# Altium schematic sheet SCH.SchDoc: MINSYS_ATMEGA328
size A4
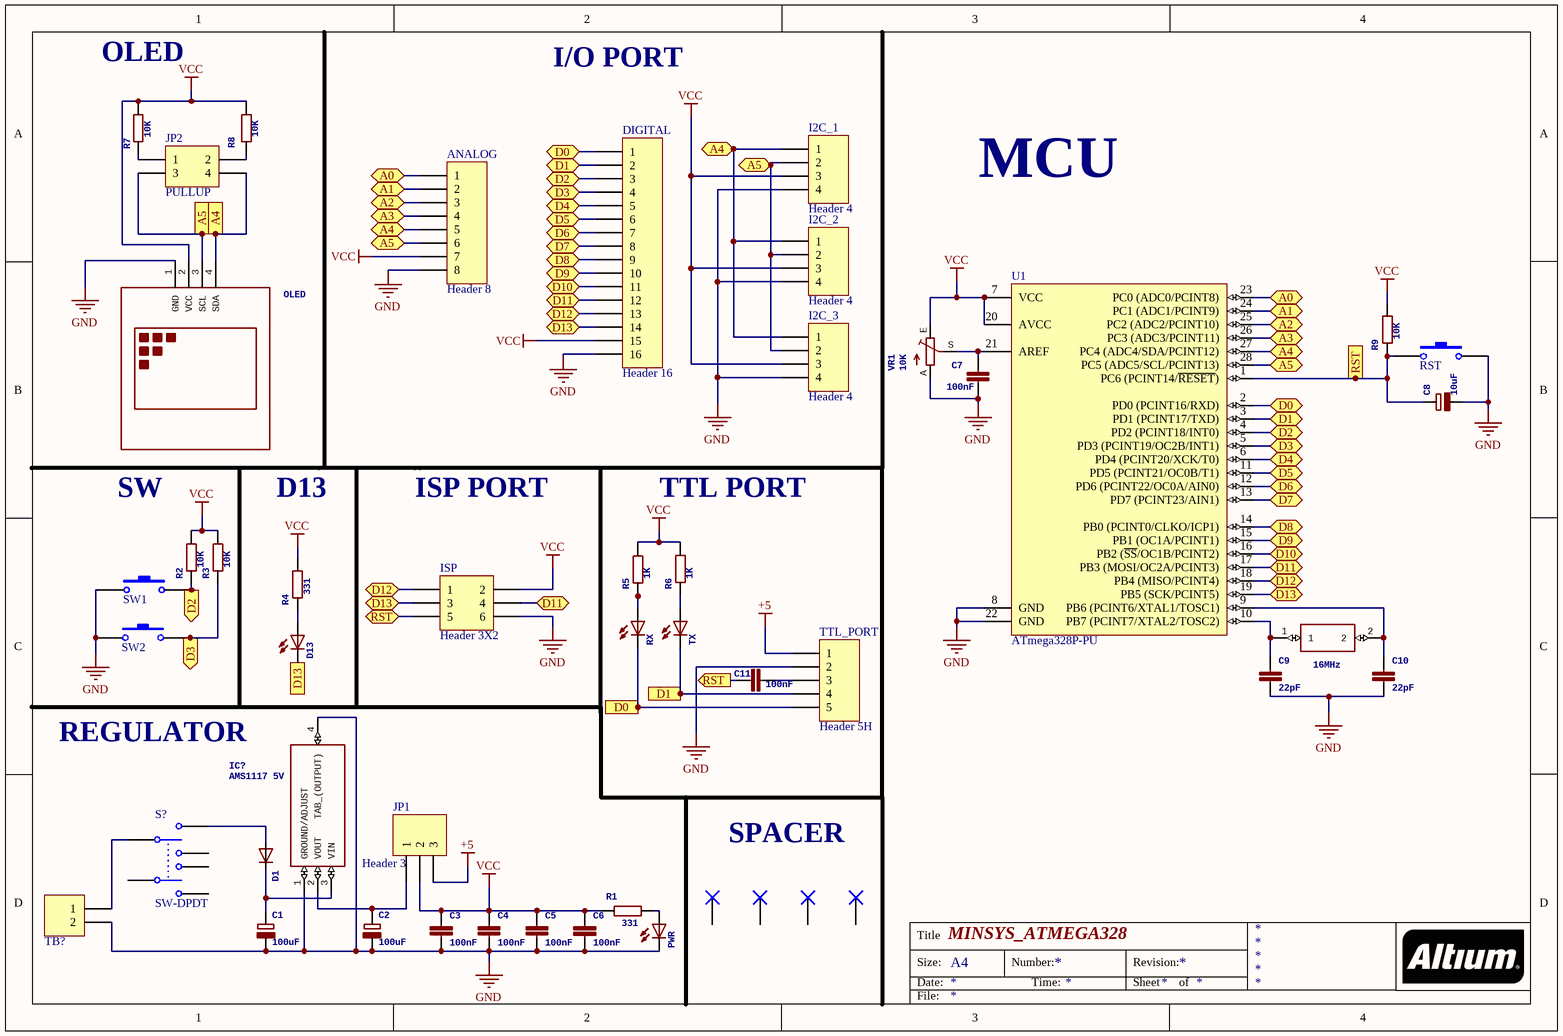
[diagram p0: SCH.SchDoc]

## Parts
(Parts that share a designator on the sheet are numbered #1, #2 ... from top to bottom, then left to right.)
?#1  Spacer  [SPACER]  (value not drawn)
?#2  Spacer  [SPACER]  (value not drawn)
?#3  Spacer  [SPACER]  (value not drawn)
?#4  Spacer  [SPACER]  (value not drawn)
ANALOG  Header 8  [HDR1X8]
C1  100uF  [153CLV-0605]
C2  100uF  [153CLV-0605]
C3  100nF  [C0805]
C4  100nF  [C0805]
C5  100nF  [C0805]
C6  100nF  [C0805]
C7  100nF  [C0805]
C8  10uF  [153CLV-0405]
C9  22pF  [C0805]
C10  22pF  [C0805]
C11  100nF  [C0805]
D1  DIODEgeneral purpose rectifier, 1 A  [DO41-10]  (value not drawn)
D13  LEDOSRAM:- CHIPLEDLG R971, LG N971, LY N971, LG Q971, LY Q971, LO R971, LY R971 LH N974, LH R974LS Q976, LO Q976, LY Q976LO Q996- Hyper CHIPLEDLW Q18SLB Q993, LB Q99A, LB R99A- SideLEDLS A670, LO A670, LY A670, LG A670, LP A670LB A673, LV A673, LT A673, LW A673LH A674LY A675LS A676, LA A676, LO A676, LY A676, LW A676LS A679, LY A679, LG A679-  Hyper Micro SIDELEDÂ®LS Y876, LA Y876, LO Y876, LY Y876LT Y87S- SmartLEDLW L88C, LW L88SLB L89C, LB L89S, LG L890LS L89K, LO L89K, LY L89KLS L896, LA L896, LO L896, LY L896- TOPLEDLS T670, LO T670, LY T670, LG T670, LP T670LSG T670, LSP T670, LSY T670, LOP T670, LYG T670LG T671, LOG T671, LSG T671LB T673, LV T673, LT T673, LW T673LH T674LS T676, LA T676, LO T676, LY T676, LB T676, LH T676, LSB T676, LW T676LB T67C, LV T67C, LT T67C, LS T67K, LO T67K, LY T67K, LW E67CLS E67B, LA E67B, LO E67B, LY E67B, LB E67C, LV E67C, LT E67CLW T67CLS T679, LY T679, LG T679LS T770, LO T770, LY T770, LG T770, LP T770LB T773, LV T773, LT T773, LW T773LH T774LS E675, LA E675, LY E675, LS T675LS T776, LA T776, LO T776, LY T776, LB T776LHGB T686LT T68C, LB T68C- Hyper Mini TOPLEDÂ®LB M676- Mini TOPLED SantanaÂ®LG M470LS M47K, LO M47K, LY M47KSource: http://www.osram.convergy.de/  [LED3MM]  (value not drawn)
DIGITAL  Header 16  [HDR1X16]
I2C_1  Header 4  [HDR1X4]
I2C_2  Header 4  [HDR1X4]
I2C_3  Header 4  [HDR1X4]
IC?  AMS1117 5V  [SOT229P700X180-4N]
ISP  Header 3X2  [HDR2X3]
JP1  Header 3  [HDR1X3]
JP2  PULLUP  [HDR2X2]
OLED  128x64 Dot Matrix OLED Module based on SSD1306 chipVariant with I2C interfaceMore details available here:http://www.instructables.com/id/Monochrome-096-i2c-OLED-display-with-arduino-SSD13/SSD1306 datasheet:https://cdn-shop.adafruit.com/datasheets/SSD1306.pdfClick here to find device on ebay.comNote: There are two variants: I2C and SPI. Search for the proper version.  [DISPLAY-OLED-128X64-I2C]  (value not drawn)
PWR  LEDOSRAM:- CHIPLEDLG R971, LG N971, LY N971, LG Q971, LY Q971, LO R971, LY R971 LH N974, LH R974LS Q976, LO Q976, LY Q976LO Q996- Hyper CHIPLEDLW Q18SLB Q993, LB Q99A, LB R99A- SideLEDLS A670, LO A670, LY A670, LG A670, LP A670LB A673, LV A673, LT A673, LW A673LH A674LY A675LS A676, LA A676, LO A676, LY A676, LW A676LS A679, LY A679, LG A679-  Hyper Micro SIDELEDÂ®LS Y876, LA Y876, LO Y876, LY Y876LT Y87S- SmartLEDLW L88C, LW L88SLB L89C, LB L89S, LG L890LS L89K, LO L89K, LY L89KLS L896, LA L896, LO L896, LY L896- TOPLEDLS T670, LO T670, LY T670, LG T670, LP T670LSG T670, LSP T670, LSY T670, LOP T670, LYG T670LG T671, LOG T671, LSG T671LB T673, LV T673, LT T673, LW T673LH T674LS T676, LA T676, LO T676, LY T676, LB T676, LH T676, LSB T676, LW T676LB T67C, LV T67C, LT T67C, LS T67K, LO T67K, LY T67K, LW E67CLS E67B, LA E67B, LO E67B, LY E67B, LB E67C, LV E67C, LT E67CLW T67CLS T679, LY T679, LG T679LS T770, LO T770, LY T770, LG T770, LP T770LB T773, LV T773, LT T773, LW T773LH T774LS E675, LA E675, LY E675, LS T675LS T776, LA T776, LO T776, LY T776, LB T776LHGB T686LT T68C, LB T68C- Hyper Mini TOPLEDÂ®LB M676- Mini TOPLED SantanaÂ®LG M470LS M47K, LO M47K, LY M47KSource: http://www.osram.convergy.de/  [LED3MM]  (value not drawn)
R1  331  [R1206]
R2  10K  [R1206]
R3  10K  [R1206]
R4  331  [R1206]
R5  1K  [R1206]
R6  1K  [R1206]
R7  10K  [R1206]
R8  10K  [R1206]
R9  10K  [R1206]
RST  But 2Pin  [PB-2Pin]  (value not drawn)
RX  LEDOSRAM:- CHIPLEDLG R971, LG N971, LY N971, LG Q971, LY Q971, LO R971, LY R971 LH N974, LH R974LS Q976, LO Q976, LY Q976LO Q996- Hyper CHIPLEDLW Q18SLB Q993, LB Q99A, LB R99A- SideLEDLS A670, LO A670, LY A670, LG A670, LP A670LB A673, LV A673, LT A673, LW A673LH A674LY A675LS A676, LA A676, LO A676, LY A676, LW A676LS A679, LY A679, LG A679-  Hyper Micro SIDELEDÂ®LS Y876, LA Y876, LO Y876, LY Y876LT Y87S- SmartLEDLW L88C, LW L88SLB L89C, LB L89S, LG L890LS L89K, LO L89K, LY L89KLS L896, LA L896, LO L896, LY L896- TOPLEDLS T670, LO T670, LY T670, LG T670, LP T670LSG T670, LSP T670, LSY T670, LOP T670, LYG T670LG T671, LOG T671, LSG T671LB T673, LV T673, LT T673, LW T673LH T674LS T676, LA T676, LO T676, LY T676, LB T676, LH T676, LSB T676, LW T676LB T67C, LV T67C, LT T67C, LS T67K, LO T67K, LY T67K, LW E67CLS E67B, LA E67B, LO E67B, LY E67B, LB E67C, LV E67C, LT E67CLW T67CLS T679, LY T679, LG T679LS T770, LO T770, LY T770, LG T770, LP T770LB T773, LV T773, LT T773, LW T773LH T774LS E675, LA E675, LY E675, LS T675LS T776, LA T776, LO T776, LY T776, LB T776LHGB T686LT T68C, LB T68C- Hyper Mini TOPLEDÂ®LB M676- Mini TOPLED SantanaÂ®LG M470LS M47K, LO M47K, LY M47KSource: http://www.osram.convergy.de/  [LED3MM]  (value not drawn)
S?  SW-DPDT  [DPDT-6]
SW1  But 2Pin  [PB-2Pin]  (value not drawn)
SW2  But 2Pin  [PB-2Pin]  (value not drawn)
TB?  T-Blok 2Pin  [TB-2P]  (value not drawn)
TTL_PORT  Header 5H  [HDR1X5H]
TX  LEDOSRAM:- CHIPLEDLG R971, LG N971, LY N971, LG Q971, LY Q971, LO R971, LY R971 LH N974, LH R974LS Q976, LO Q976, LY Q976LO Q996- Hyper CHIPLEDLW Q18SLB Q993, LB Q99A, LB R99A- SideLEDLS A670, LO A670, LY A670, LG A670, LP A670LB A673, LV A673, LT A673, LW A673LH A674LY A675LS A676, LA A676, LO A676, LY A676, LW A676LS A679, LY A679, LG A679-  Hyper Micro SIDELEDÂ®LS Y876, LA Y876, LO Y876, LY Y876LT Y87S- SmartLEDLW L88C, LW L88SLB L89C, LB L89S, LG L890LS L89K, LO L89K, LY L89KLS L896, LA L896, LO L896, LY L896- TOPLEDLS T670, LO T670, LY T670, LG T670, LP T670LSG T670, LSP T670, LSY T670, LOP T670, LYG T670LG T671, LOG T671, LSG T671LB T673, LV T673, LT T673, LW T673LH T674LS T676, LA T676, LO T676, LY T676, LB T676, LH T676, LSB T676, LW T676LB T67C, LV T67C, LT T67C, LS T67K, LO T67K, LY T67K, LW E67CLS E67B, LA E67B, LO E67B, LY E67B, LB E67C, LV E67C, LT E67CLW T67CLS T679, LY T679, LG T679LS T770, LO T770, LY T770, LG T770, LP T770LB T773, LV T773, LT T773, LW T773LH T774LS E675, LA E675, LY E675, LS T675LS T776, LA T776, LO T776, LY T776, LB T776LHGB T686LT T68C, LB T68C- Hyper Mini TOPLEDÂ®LB M676- Mini TOPLED SantanaÂ®LG M470LS M47K, LO M47K, LY M47KSource: http://www.osram.convergy.de/  [LED3MM]  (value not drawn)
U1  ATmega328P-PU  [28P3]
VR1  10K  [S64W]
xtal  16MHz  [9C7680MBBKT]

## Ports
A0 (bidir), A1 (bidir), A2 (bidir), A3 (bidir), A4 (bidir), A4 (in), A5 (bidir), A5 (in), D0 (bidir), D0 (out), D1 (bidir), D1 (out), D2 (bidir), D2 (out), D3 (bidir), D3 (out), D4 (bidir), D5 (bidir), D6 (bidir), D7 (bidir), D8 (bidir), D9 (bidir), D10 (bidir), D11 (bidir), D12 (bidir), D13 (bidir), D13 (in), RST (bidir), RST (in), RST (out)

## Nets
+5: JP1.3 TTL_PORT.1
GND: ANALOG.8 C1.- C2.- C3.2 C4.2 C5.2 C6.2 C7.2 C8.- C9.2 C10.2 DIGITAL.16 I2C_1.4 I2C_2.4 I2C_3.4 IC?.1(GROUND/ADJUST) IC?.4(TAB_(OUTPUT)) ISP.6 OLED.1(GND) PWR.K(C) RST.2 SW1.1 SW2.1 TB?.2 TTL_PORT.2 U1.8(GND) U1.22(GND) VR1.A
VCC: ANALOG.7 C3.1 C4.1 C5.1 C6.1 DIGITAL.15 I2C_1.3 I2C_2.3 I2C_3.3 ISP.2 JP1.2 OLED.2(VCC) R1.1 R2.2 R3.2 R4.2 R5.2 R6.2 R7.2 R8.2 R9.2 U1.7(VCC) U1.20(AVCC) VR1.E
A0: ANALOG.1 U1.23(PC0_(ADC0/PCINT8)) ; port A0
A1: ANALOG.2 U1.24(PC1_(ADC1/PCINT9)) ; port A1
A2: ANALOG.3 U1.25(PC2_(ADC2/PCINT10)) ; port A2
A3: ANALOG.4 U1.26(PC3_(ADC3/PCINT11)) ; port A3
A4: ANALOG.5 I2C_1.1 I2C_2.1 I2C_3.1 JP2.4 OLED.4(SDA) U1.27(PC4_(ADC4/SDA/PCINT12)) ; port A4
A5: ANALOG.6 I2C_1.2 I2C_2.2 I2C_3.2 JP2.3 OLED.3(SCL) U1.28(PC5_(ADC5/SCL/PCINT13)) ; port A5
D0: DIGITAL.1 RX.K(C) TTL_PORT.5 U1.2(PD0_(PCINT16/RXD)) ; port D0
D1: DIGITAL.2 TTL_PORT.4 TX.K(C) U1.3(PD1_(PCINT17/TXD)) ; port D1
D2: DIGITAL.3 R2.1 SW1.2 U1.4(PD2_(PCINT18/INT0)) ; port D2
D3: DIGITAL.4 R3.1 SW2.2 U1.5(PD3_(PCINT19/OC2B/INT1)) ; port D3
D4: DIGITAL.5 U1.6(PD4_(PCINT20/XCK/T0)) ; port D4
D5: DIGITAL.6 U1.11(PD5_(PCINT21/OC0B/T1)) ; port D5
D6: DIGITAL.7 U1.12(PD6_(PCINT22/OC0A/AIN0)) ; port D6
D7: DIGITAL.8 U1.13(PD7_(PCINT23/AIN1)) ; port D7
D8: DIGITAL.9 U1.14(PB0_(PCINT0/CLKO/ICP1)) ; port D8
D9: DIGITAL.10 U1.15(PB1_(OC1A/PCINT1)) ; port D9
D10: DIGITAL.11 U1.16(PB2_(~{SS}/OC1B/PCINT2)) ; port D10
D11: DIGITAL.12 ISP.4 U1.17(PB3_(MOSI/OC2A/PCINT3)) ; port D11
D12: DIGITAL.13 ISP.1 U1.18(PB4_(MISO/PCINT4)) ; port D12
D13: D13.K(C) DIGITAL.14 ISP.3 U1.19(PB5_(SCK/PCINT5)) ; port D13
RST: C8.+ C11.1 ISP.5 R9.1 RST.1 U1.1(PC6_(PCINT14/~{RESET})) ; port RST
NetC1_+: C1.+ D1.C IC?.3(VIN)
NetC2_+: C2.+ IC?.2(VOUT) JP1.1
NetC7_1: C7.1 U1.21(AREF) VR1.S
NetC9_1: C9.1 U1.10(PB7_(PCINT7/XTAL2/TOSC2)) xtal.1
NetC10_1: C10.1 U1.9(PB6_(PCINT6/XTAL1/TOSC1)) xtal.2
NetC11_2: C11.2 TTL_PORT.3
NetD1_A: D1.A S?.2
NetD13_A: D13.A R4.1
NetJP2_1: JP2.1 R7.1
NetJP2_2: JP2.2 R8.1
NetPWR_A: PWR.A R1.2
NetR5_1: R5.1 RX.A
NetR6_1: R6.1 TX.A
NetS?_1: S?.1 TB?.1

Not connected (* = marked no-connect by the designer): ?#1 1; ?#2 1; ?#3 1; ?#4 1; S? 3 4 5 6

## Notes on the sheet
- (near R7) OLED
- I/O PORT
- MCU
- SW
- D13
- ISP PORT
- TTL PORT
- REGULATOR
- SPACER
- Title
- Size:
- Date:
- A4
- Number:
- Time:
- Revision:
- Sheet
- of
- File:

## Library data of the parts
ANALOG = Header 8: Header, 8-Pin; LatestRevisionDate: 17-Jul-2002; LatestRevisionNote: Re-released for DXP Platform.; Publisher: Altium Limited
C1 C2 = CPOL-EU153CLV-0605: GateName_1: G$1; SymbolName_1: CPOL; DeviceName: 153CLV-0605; LibraryName: rcl; DeviceSetName: CPOL-EU; Package: 153CLV-0605
C3-C7 C9-C11 = C-EUC0805: GateName_1: G$1; SymbolName_1: C-EU; DeviceName: C0805; LibraryName: rcl; DeviceSetName: C-EU; Package: C0805
C8 = CPOL-EU153CLV-0405: GateName_1: G$1; SymbolName_1: CPOL; DeviceName: 153CLV-0405; LibraryName: rcl; DeviceSetName: CPOL-EU; Package: 153CLV-0405
D1 = 1N4004: GateName_1: 1; SymbolName_1: D; LibraryName: diode; DeviceSetName: 1N4004; Package: DO41-10
D13 PWR RX TX = LED3MM: GateName_1: G$1; SymbolName_1: LED; DeviceName: 3MM; LibraryName: led; DeviceSetName: LED; Package: LED3MM
DIGITAL = Header 16: Header, 16-Pin; LatestRevisionDate: 17-Jul-2002; LatestRevisionNote: Re-released for DXP Platform.; Publisher: Altium Limited
I2C_1-I2C_3 = Header 4: Header, 4-Pin; LatestRevisionDate: 17-Jul-2002; LatestRevisionNote: Re-released for DXP Platform.; Publisher: Altium Limited
IC? = AMS1117-3.3V: Manufacturer_Name: Advanced Monolithic Systems; GateName_1: G$1; SymbolName_1: AMS1117-3.3V; LibraryName: ams1117-3.3v; DeviceSetName: AMS1117-3.3V; Package: SOT229P700X180-4N; Manufacturer_Part_Number: ams1117-3.3v; Height: 1.8mm
ISP = Header 3X2: Header, 3-Pin, Dual row; LatestRevisionDate: 17-Jul-2002; LatestRevisionNote: Re-released for DXP Platform.; Publisher: Altium Limited
JP1 = Header 3: Header, 3-Pin; LatestRevisionDate: 17-Jul-2002; LatestRevisionNote: Re-released for DXP Platform.; Publisher: Altium Limited
JP2 = Header 2X2: Header, 2-Pin, Dual row; LatestRevisionDate: 17-Jul-2002; LatestRevisionNote: Re-released for DXP Platform.; Publisher: Altium Limited
OLED = DISPLAY-OLED-128X64-I2C: GateName_1: G$1; SymbolName_1: DISPLAY-OLED-128X64-I2C; LibraryName: MASTER; DeviceSetName: DISPLAY-OLED-128X64-I2C; Package: DISPLAY-OLED-128X64-I2C
R1-R9 = R-EU_R1206: GateName_1: G$1; SymbolName_1: R-EU; DeviceSetName: R-EU_; DeviceName: R1206; LibraryName: rcl; Package: R1206
RST SW1 SW2 = But 2Pin: Push Button 2Pin
S? = SW-DPDT: Double-Pole, Double-Throw Switch; Published: 24-Mar-1999; LatestRevisionDate: 17-Jul-2002; LatestRevisionNote: Re-released for DXP Platform.; PackageReference: DPDT-6; Publisher: Altium Limited; PackageDescription: Switch; 6 Leads
TB? = T-Blok 2Pin: Terminal Blok 2Pin
TTL_PORT = Header 5H: Header, 5-Pin, Right Angle; LatestRevisionDate: 17-Jul-2002; LatestRevisionNote: Re-released for DXP Platform.; Publisher: Altium Limited
U1 = ATmega328P-PU: 8-bit AVR Microcontroller, 32KB Flash, 1KB EEPROM, 2KB SRAM, 28-pin PDIP, Industrial Grade (-40°C to 85°C); Published: 1-Apr-2010; DatasheetVersion: revA, Jan-2010; PackageVersion: revB, Sep-2001; PackageReference: 28P3; Publisher: Altium Limited; PackageDescription: 28-lead (0.300"/7.62mm Wide) Plastic Dual Inline Package (PDIP); Supplier 1: Digi-Key; Supplier Part Number 1: ATMEGA328P-PU-ND; Supplier 2: Farnell; Supplier Part Number 2: 1715487; Supplier 3: Mouser; Supplier Part Number 3: 556-ATMEGA328P-PU; ComponentLink1Description: Manufacturer Link; ComponentLink1URL: http://www.atmel.com/products/avr/default.asp?; ComponentLink2Description: ATmega48A/48PA/88A/88PA/168A/168PA/328/328P Datasheet; ComponentLink2URL: http://www.atmel.com/dyn/resources/prod_documents/8271.pdf; ComponentLink3Description: ATmega48A/48PA/88A/88PA/168A/168PA/328/328P Summary; ComponentLink3URL: http://www.atmel.com/dyn/resources/prod_documents/8271S.pdf; ComponentLink4Description: Atmel.com Home; ComponentLink4URL: http://www.atmel.com
VR1 = TRIM_EU-S64W: GateName_1: 1; SymbolName_1: TPOT; DeviceName: S64W; LibraryName: pot; DeviceSetName: TRIM_EU-; Package: S64W
xtal = 9C-8.000MEEJ-T: Manufacturer_Name: TXC; GateName_1: G$1; SymbolName_1: 9C-8.000MEEJ-T; LibraryName: 9C-8.000MEEJ-T; DeviceSetName: 9C-8.000MEEJ-T; Package: 9C7680MBBKT; Manufacturer_Part_Number: 9C-8.000MEEJ-T; Mouser_Part_Number: 717-9C-8.000MEEJ-T; Mouser_Price-Stock: https://www.mouser.com/Search/Refine.aspx?Keyword=717-9C-8.000MEEJ-T; Height: 3.8mm